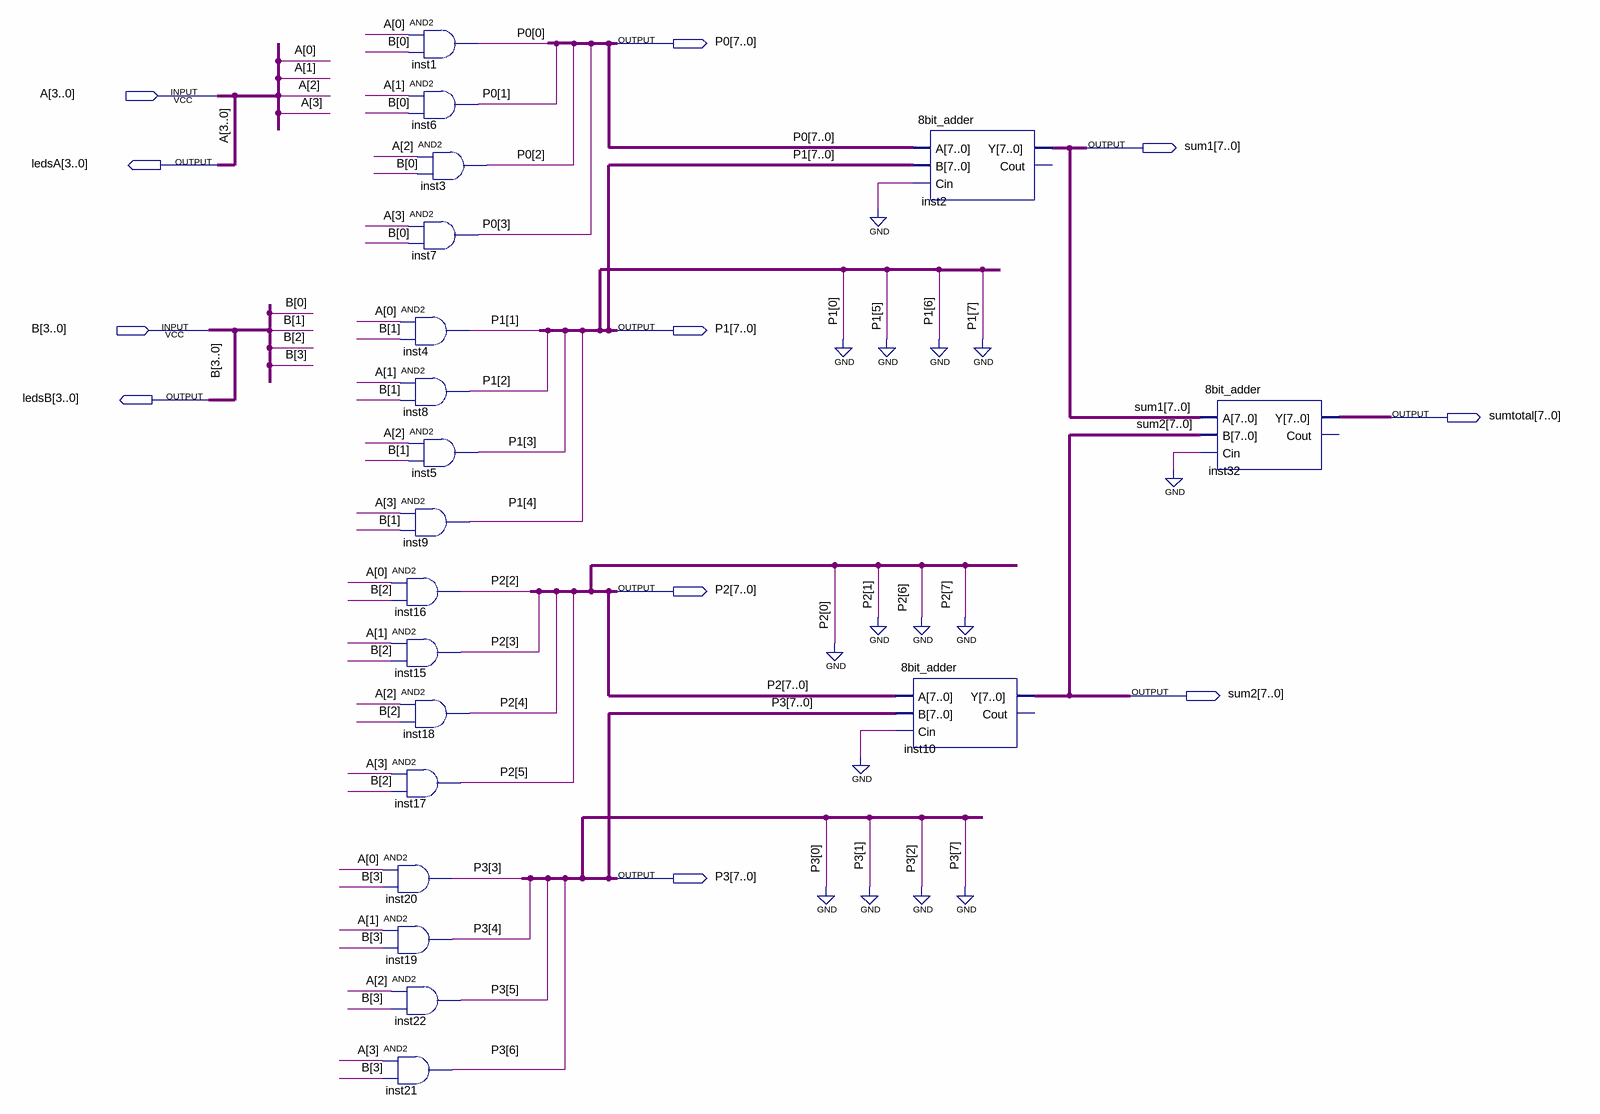
[diagram p0: schematic sheet]
// Quartus schematic Multiplier.bdf as structural Verilog: 19 symbols, 11 pins
module Multiplier (
  input  [3:0] A,
  input  [3:0] B,
  output [7:0] P0,
  output [7:0] sum1,
  output [3:0] ledsA,
  output [7:0] P1,
  output [3:0] ledsB,
  output [7:0] sumtotal,
  output [7:0] P2,
  output [7:0] sum2,
  output [7:0] P3
);

  and inst1 (P0[0], A[0], B[0]);
  and inst6 (P0[1], A[1], B[0]);
  and inst7 (P0[3], A[3], B[0]);
  and inst4 (P1[1], A[0], B[1]);
  and inst8 (P1[2], A[1], B[1]);
  and inst5 (P1[3], A[2], B[1]);
  and inst9 (P1[4], A[3], B[1]);
  and inst16 (P2[2], A[0], B[2]);
  and inst15 (P2[3], A[1], B[2]);
  and inst18 (P2[4], A[2], B[2]);
  and inst17 (P2[5], A[3], B[2]);
  and inst20 (P3[3], A[0], B[3]);
  and inst19 (P3[4], A[1], B[3]);
  and inst22 (P3[5], A[2], B[3]);
  and inst21 (P3[6], A[3], B[3]);
  and inst3 (P0[2], A[2], B[0]);
  \8bit_adder  inst10 (.A({2'b00, P2[5:2], 2'b00}), .B({1'b0, P3[6:3], 3'b000}), .Cin(1'b0), .Y(sum2));  // open: Cout
  \8bit_adder  inst2 (.A(P0), .B({3'b000, P1[4:1], 1'b0}), .Cin(1'b0), .Y(sum1));  // open: Cout
  \8bit_adder  inst32 (.A(sum1), .B(sum2), .Cin(1'b0), .Y(sumtotal));  // open: Cout

  assign ledsA = A;
  assign ledsB = B;
  assign {P1[7:5], P1[0]} = 4'b0000;
  assign {P2[7:6], P2[1:0]} = 4'b0000;
  assign {P3[7], P3[2:0]} = 4'b0000;
endmodule
